# EAGLE schematic lcd (EAGLE 7.6.0)
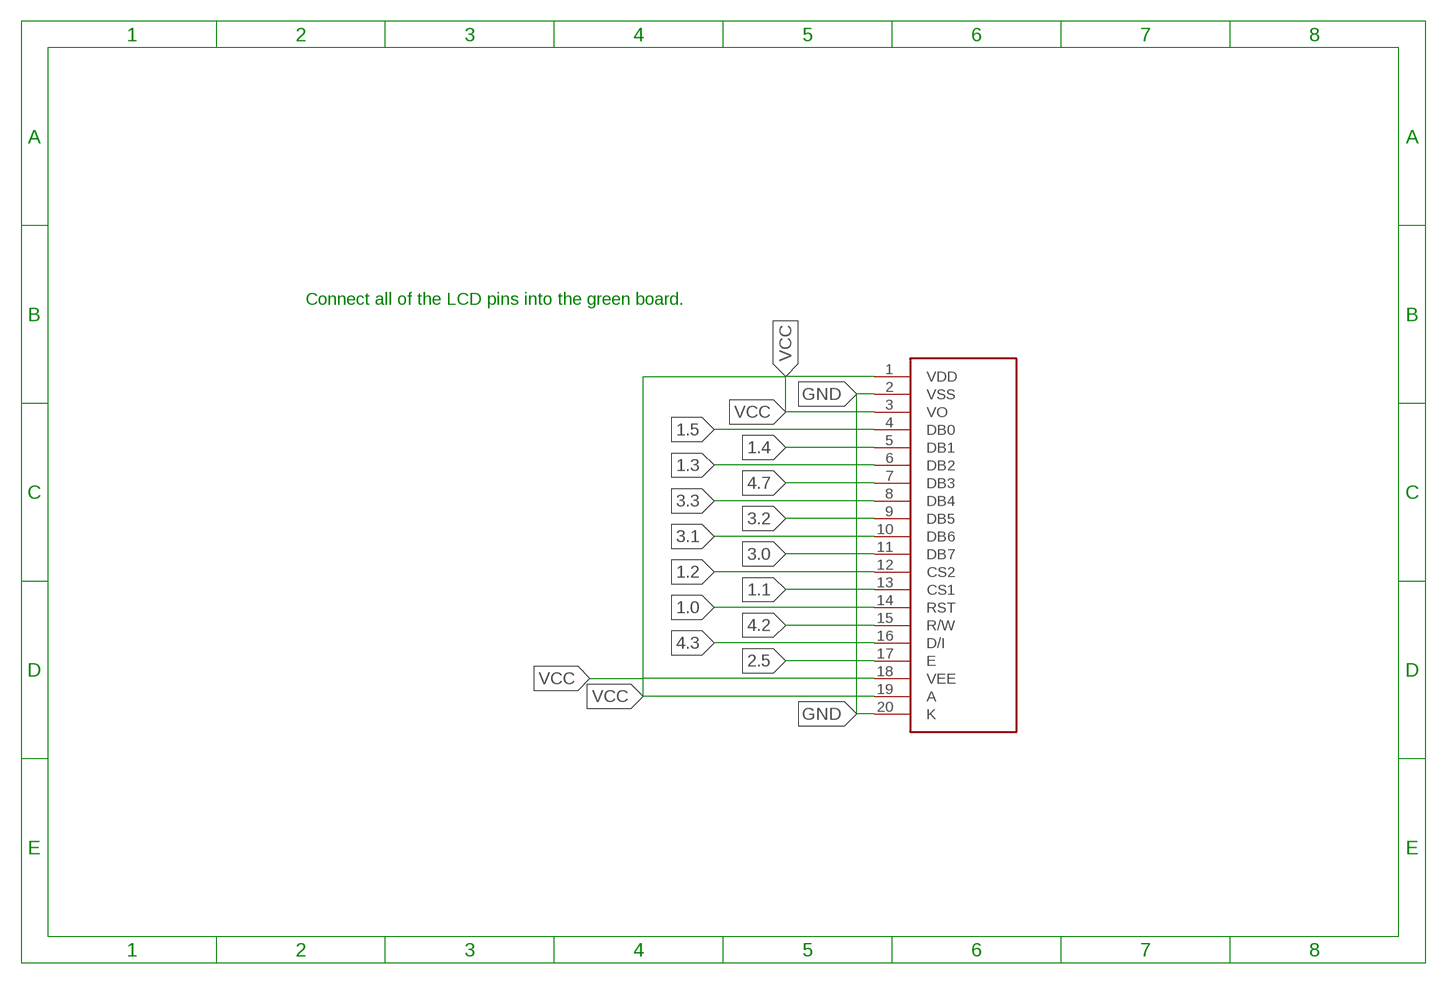
[diagram p0: schematic, sheet 1]

## Parts
U$1  LCD-G12864FULL  [LCD-G12864]

## Nets
1.0: U$1.14(RST)
1.1: U$1.13(CS1)
1.2: U$1.12(CS2)
1.3: U$1.6(DB2)
1.4: U$1.5(DB1)
1.5: U$1.4(DB0)
2.5: U$1.17(E)
3.0: U$1.11(DB7)
3.1: U$1.10(DB6)
3.2: U$1.9(DB5)
3.3: U$1.8(DB4)
4.2: U$1.15(R/W)
4.3: U$1.16(D/I)
4.7: U$1.7(DB3)
GND: U$1.2(VSS) U$1.20(K)
VCC: U$1.1(VDD) U$1.3(VO) U$1.18(VEE) U$1.19(A)

## Notes on the sheet
- Connect all of the LCD pins into the green board.

## Library data of the parts
U$1 = SparkFun-Displays:LCD-G12864: Graphical LCD 128x64 Footprint is not yet proven. Double check it. Spark Fun Electronics SKU : LCD-00710